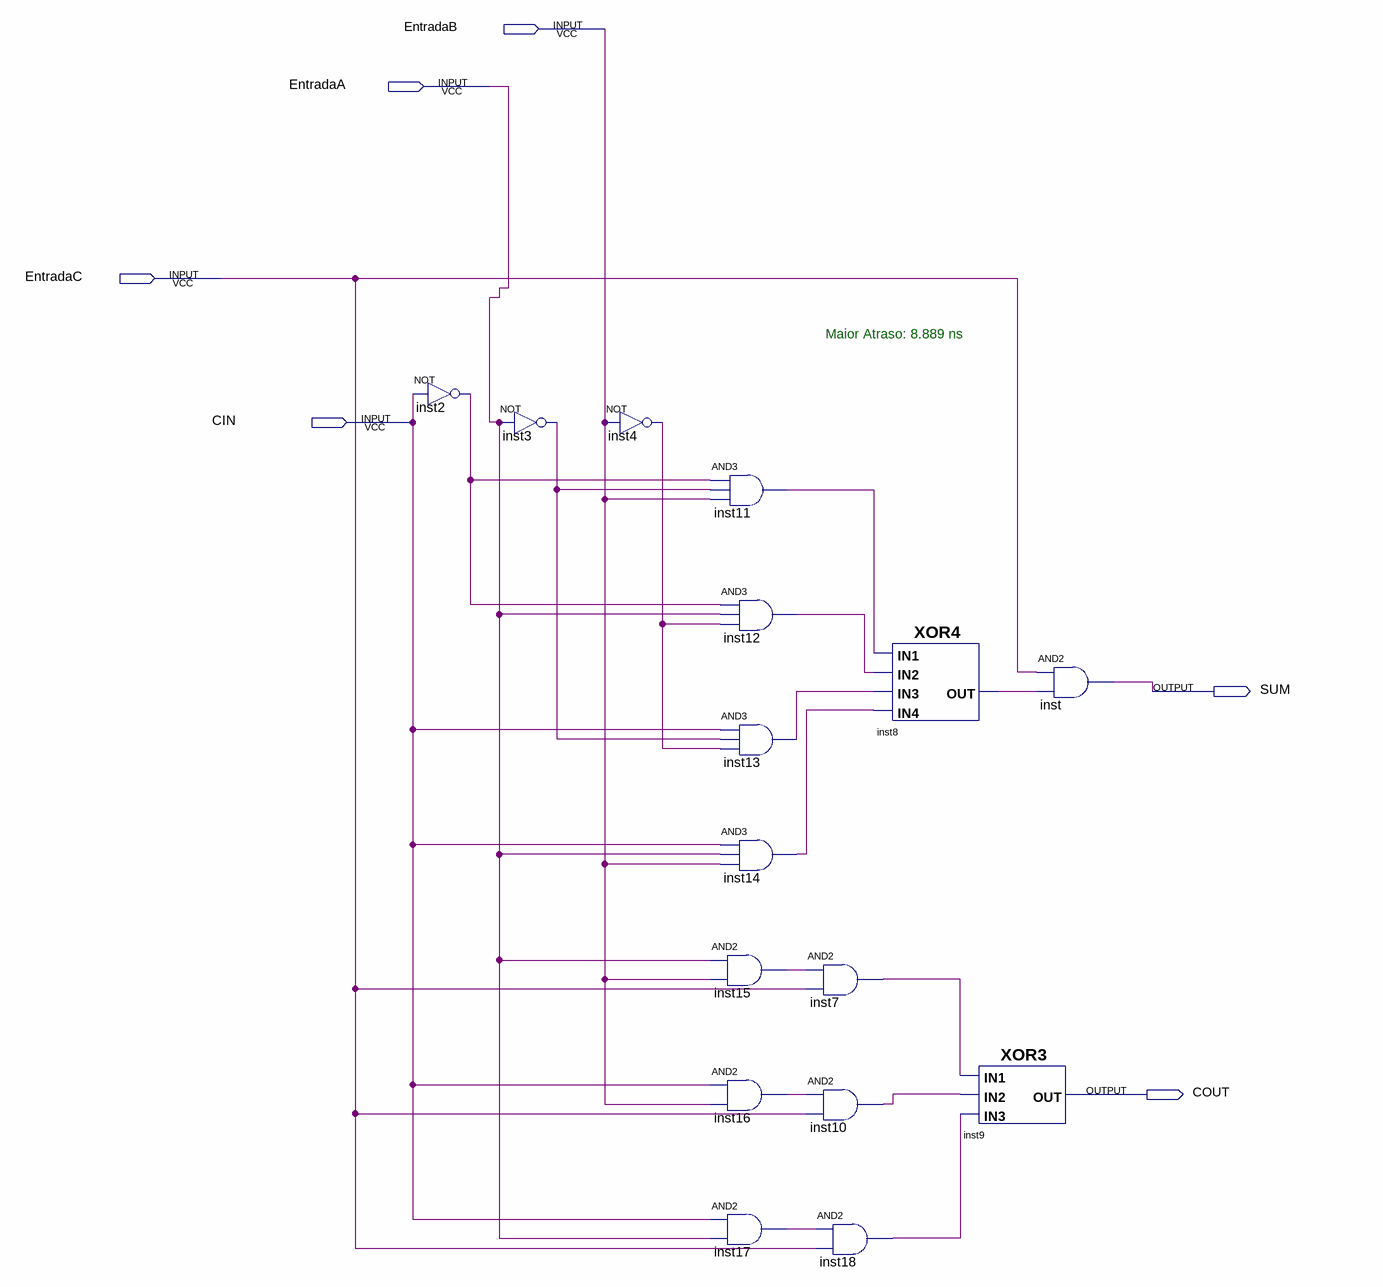
[diagram p0: schematic sheet]
// Quartus schematic FullAdder_1bit.bdf as structural Verilog: 16 symbols, 6 pins
module FullAdder_1bit (
  input  EntradaB,
  input  EntradaA,
  input  EntradaC,
  input  CIN,
  output SUM,
  output COUT
);

  wire inst2_out, inst3_out, inst4_out, inst7_out, inst8_out, inst10_out, inst11_out, inst12_out, inst13_out,
       inst14_out, inst15_out, inst16_out, inst17_out, inst18_out;

  not inst2 (inst2_out, CIN);
  not inst3 (inst3_out, EntradaA);
  not inst4 (inst4_out, EntradaB);
  and inst11 (inst11_out, inst2_out, inst3_out, EntradaB);
  and inst12 (inst12_out, inst2_out, EntradaA, inst4_out);
  and inst13 (inst13_out, CIN, inst3_out, inst4_out);
  and inst14 (inst14_out, CIN, EntradaA, EntradaB);
  and inst15 (inst15_out, EntradaA, EntradaB);
  and inst16 (inst16_out, CIN, EntradaB);
  and inst17 (inst17_out, CIN, EntradaA);
  and inst7 (inst7_out, inst15_out, EntradaC);
  and inst10 (inst10_out, inst16_out, EntradaC);
  and inst18 (inst18_out, inst17_out, EntradaC);
  XOR4 inst8 (.IN3(inst13_out), .IN4(inst14_out), .IN2(inst12_out), .IN1(inst11_out), .OUT(inst8_out));
  XOR3 inst9 (.IN3(inst18_out), .IN1(inst7_out), .IN2(inst10_out), .OUT(COUT));
  and inst (SUM, EntradaC, inst8_out);

  // Notes on the sheet:
  //   Maior Atraso: 8.889 ns
endmodule
